# Altium schematic sheet bbr18_ball_sensor_board.SchDoc
size A4
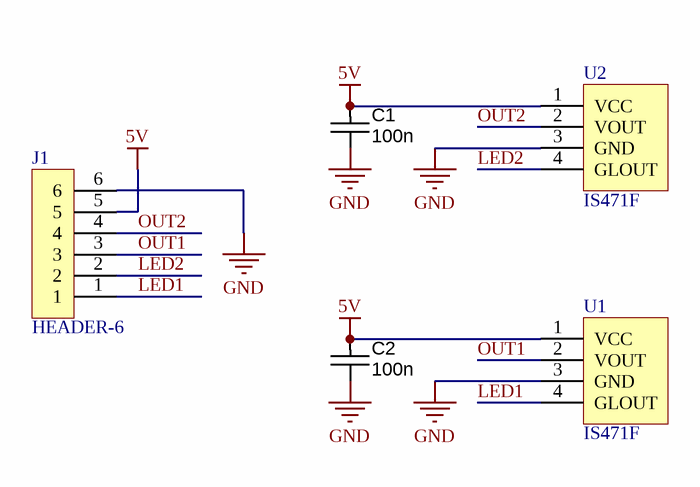
[diagram p0: bbr18_ball_sensor_board.SchDoc]

## Parts
C1  100n  [CAPC1608X90N]
C2  100n  [CAPC1608X90N]
J1  HEADER-6  [MICRO-MATCH-MOB-06]
U1  IS471F  [IS471F]
U2  IS471F  [IS471F]

## Nets
5V: C1.1 C2.1 J1.5 U1.1(VCC) U2.1(VCC)
GND: C1.2 C2.2 J1.6 U1.3(GND) U2.3(GND)
LED1: J1.1 U1.4(GLOUT)
LED2: J1.2 U2.4(GLOUT)
OUT1: J1.3 U1.2(VOUT)
OUT2: J1.4 U2.2(VOUT)

## Notes on the sheet
- Size:
- Date:
- A4
- Sheet
- Drawn by:
- of
- Revision:
- SmartStuff OÜ
- Näituse 26
- 50407 Tartu
- Estonia
- File name:

## Library data of the parts
C1 C2 = CAPC_100n_0603_X7R_50V_10%: Capacitor SMD Cer 100nF 10% 50V X7R 0603; Manufacturer 1: AVX Corporation; Manufacturer Part Number 1: 06035C104KAT2A; Ratings: 50V; X7R; Material: ceramic; SCDType: spec; Manufacturer 2: TDK Corporation; Manufacturer Part Number 2: C1608X7R1H104K; Package / Case: 0603 (1608 Metric); Tolerance: ±10%; Supplier 1: Digi-Key; Supplier Part Number 1: 478-5052-1-ND; ComponentLink1URL: http://www.avx.com/docs/Catalogs/cx7r.pdf; ComponentLink1Description: http://www.avx.com/docs/Catalogs/cx7r.pdf; Supplier 2: Digi-Key; Supplier Part Number 2: 445-1314-1-ND; ComponentLink2URL: http://product.tdk.com/capacitor/mlcc/en/documents/mlcc_commercial_general_en.pdf; ComponentLink2Description: http://product.tdk.com/capacitor/mlcc/en/documents/mlcc_commercial_general_en.pdf; Value: 100n